# EAGLE design Fluxamasynth32 (EAGLE 9.0.0)
ABBREV: Flux3; AUTHOR: Nadya B.; PROJECT: Fluxamasynth 3
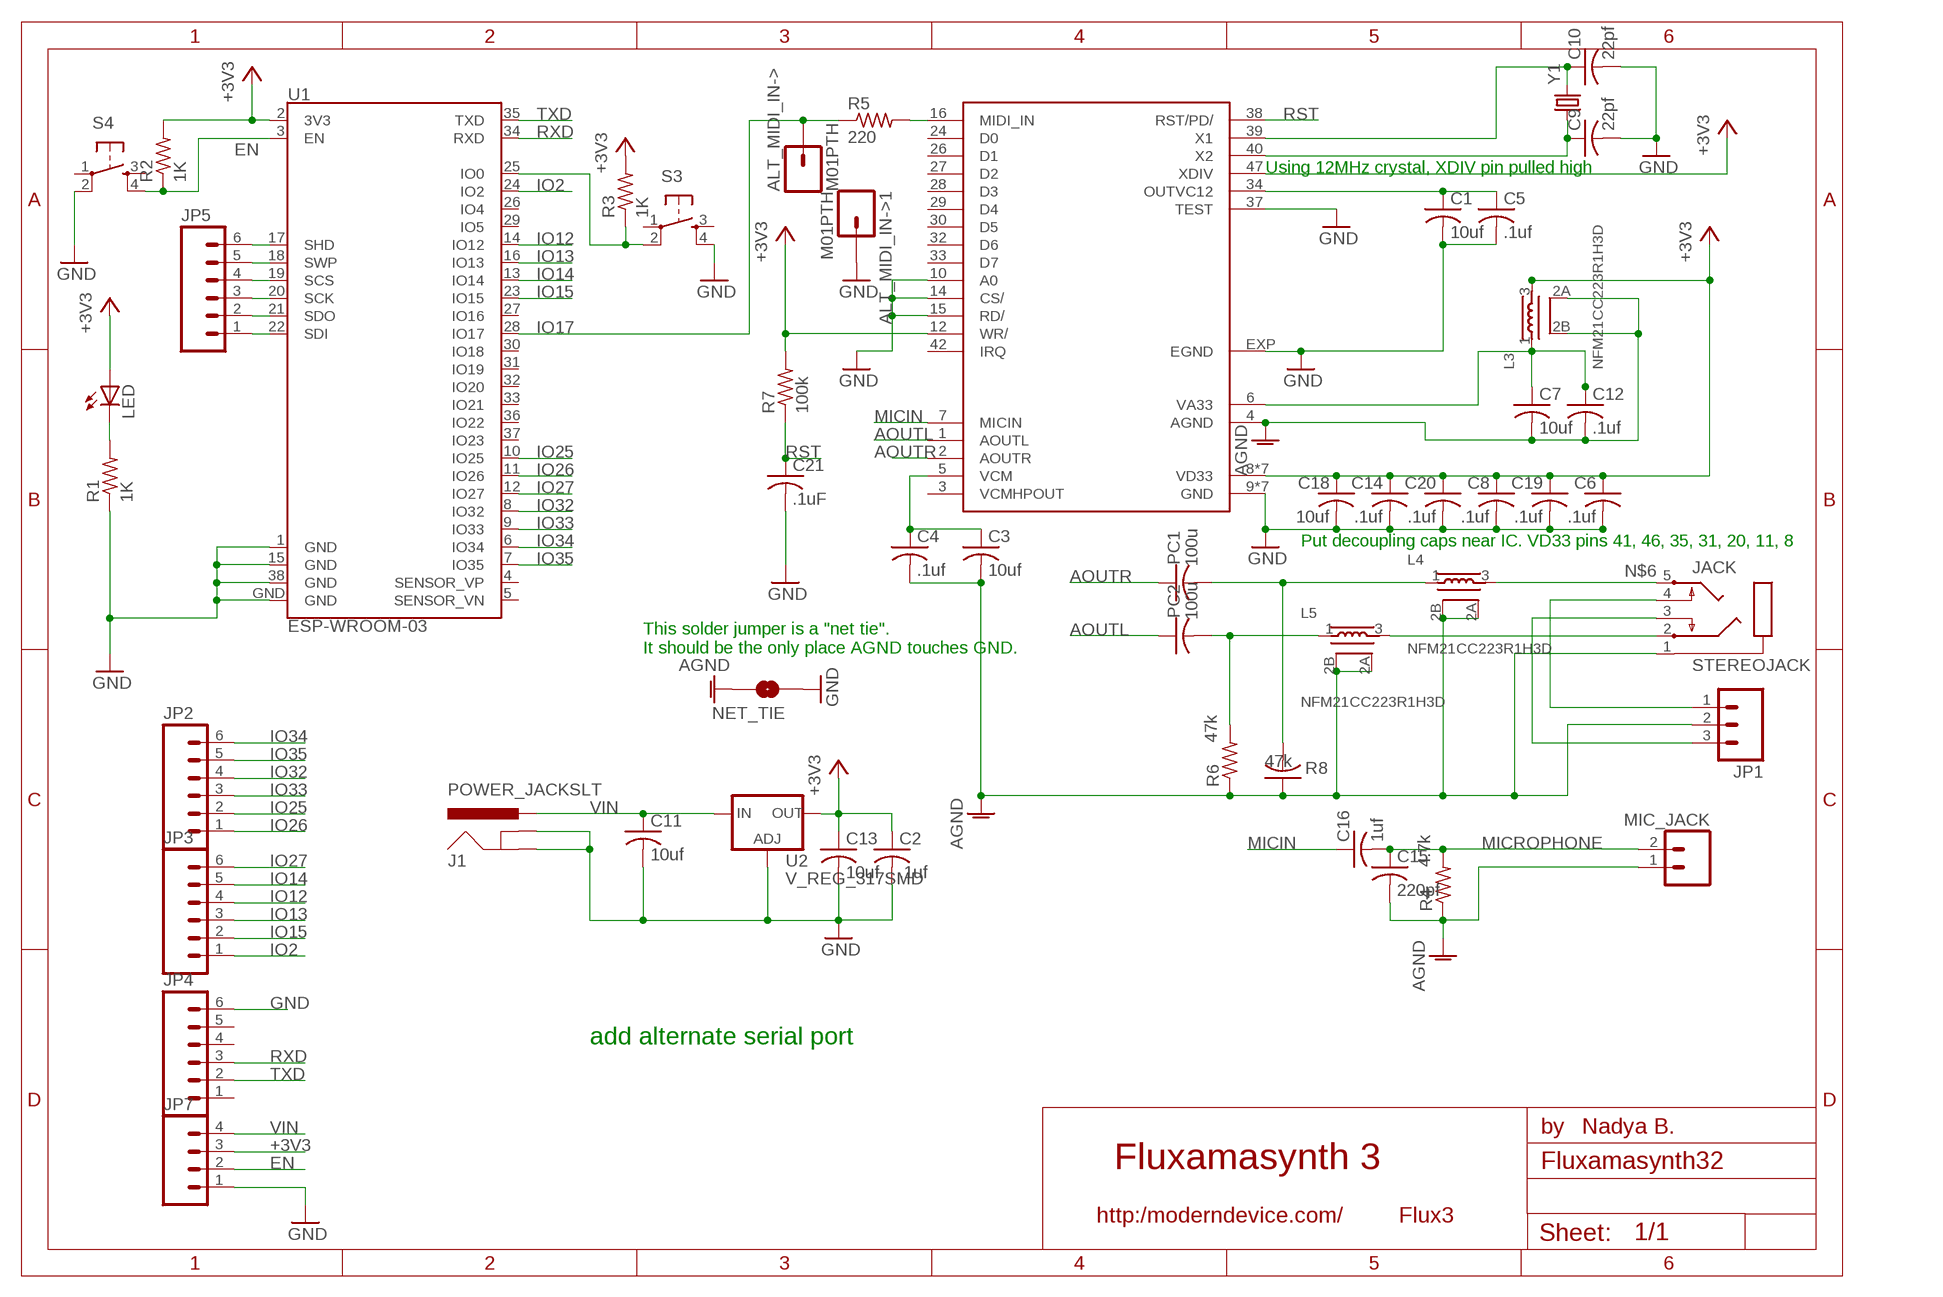
[diagram p0: schematic, sheet 1]

## Parts
ALT_MIDI_IN->  M01PTH  [1X01]
ALT_MIDI_IN->1  M01PTH  [1X01]
C1  10uf  C-USC0805K  [C0805K]
C2  .1uf  C-USC0603K  [C0603K]
C3  10uf  C-USC0805K  [C0805K]
C4  .1uf  C-USC0603K  [C0603K]
C5  .1uf  C-USC0603K  [C0603K]
C6  .1uf  C-USC0603K  [C0603K]
C7  10uf  C-USC0805K  [C0805K]
C8  .1uf  C-USC0603K  [C0603K]
C9  22pf  C-USC0603  [C0603]
C10  22pf  C-USC0603  [C0603]
C11  10uf  C-USC1206  [C1206]
C12  .1uf  C-USC0603K  [C0603K]
C13  10uf  C-USC1206  [C1206]
C14  .1uf  C-USC0603K  [C0603K]
C15  220pf  C-USC0805K  [C0805K]
C16  1uf  C-USC0603K  [C0603K]
C18  10uf  C-USC0603K  [C0603K]
C19  .1uf  C-USC0603K  [C0603K]
C20  .1uf  C-USC0603K  [C0603K]
C21  .1uF  C-USC0603K  [C0603K]
J1  POWER_JACKSLT  [POWER_JACK_SLOT]
JACK  STEREOJACK  [STX3100]
JP1  M03PTH  [1X03]
JP2  M06NO_SILK  [1X06_NO_SILK]
JP3  M06NO_SILK  [1X06_NO_SILK]
JP4  M06NO_SILK  [1X06_NO_SILK]
JP5  M06NO_SILK  [1X06_NO_SILK]
JP7  M041X04_NO_SILK  [1X04_NO_SILK]
L3  NFM21CC223R1H3D  [3PC]
L4  NFM21CC223R1H3D  [3PC]
L5  NFM21CC223R1H3D  [3PC]
LED  LED0603  [LED-0603]
MIC_JACK  M02PTH  [1X02]
NET_TIE  MODERNDEVICE_SOLDERJUMPERTRACE  [MODERNDEVICE_SJ_2S-TRACE]
PC1  100u  C-USC1206K  [C1206K]
PC2  100u  C-USC1206K  [C1206K]
R1  1K  R-US_R0603  [R0603]
R2  1K  R-US_R0603  [R0603]
R3  1K  R-US_R0603  [R0603]
R4  4.7k  R-US_R0603  [R0603]
R5  220  R-US_R0603  [R0603]
R6  47k  R-US_R0603  [R0603]
R7  100k  R-US_R0603  [R0603]
R8  47k  C-USC0603K  [C0603K]
S3  6MM_SWITCH6MM_SWITCH  [6MM_SWITCH]
S4  6MM_SWITCH6MM_SWITCH  [6MM_SWITCH]
SAM2695  SAM2695  [QFN48]
U1  ESP-WROOM-03  [ESP-WROOM-03]
U2  V_REG_317SMD  [SOT223]
Y1  CRYSTALTXC-7A  [CRYSTAL-TXC-7A]

## Nets
+3V3 [VCC]: C2.1 C6.1 C8.1 C13.1 C14.1 C18.1 C19.1 C20.1 JP7.3 L3.3 LED.A R2.2 R3.2 R7.2 SAM2695.8(VD33) SAM2695.11(VD33) SAM2695.12(WR/) SAM2695.20(VD33) SAM2695.31(VD33) SAM2695.35(VD33) SAM2695.41(VD33) SAM2695.46(VD33) SAM2695.47(XDIV) U1.2(3V3) U2.2(OUT) U2.4(OUT)
AGND [GND]: C3.2 C4.2 C7.2 C12.2 C15.2 JACK.1 JP1.2 L3.2A L3.2B L4.2A L4.2B L5.2A L5.2B MIC_JACK.1 NET_TIE.2 R4.1 R6.1 R8.1 SAM2695.4(AGND)
AOUTL: PC2.1 SAM2695.1(AOUTL)
AOUTR: PC1.1 SAM2695.2(AOUTR)
EN: JP7.2 R2.1 S4.4(S1) U1.3(EN)
GND [GND]: ALT_MIDI_IN->1.1 C1.2 C2.2 C5.2 C6.2 C8.2 C9.2 C10.2 C11.2 C13.2 C14.2 C18.2 C19.2 C20.2 C21.2 J1.GND@1(GNDBREAK) J1.GND@2(GND) JP4.6 JP7.1 NET_TIE.1 R1.1 S3.4(S1) S4.2(P1) SAM2695.9(GND) SAM2695.10(A0) SAM2695.13(GND) SAM2695.14(CS/) SAM2695.15(RD/) SAM2695.18(GND) SAM2695.25(GND) SAM2695.36(GND) SAM2695.37(TEST) SAM2695.45(GND) SAM2695.48(GND) SAM2695.EXP(EGND) U1.1(GND) U1.15(GND) U1.38(GND) U1.GND U2.1(ADJ)
IO2: JP3.1 U1.24(IO2)
IO12: JP3.4 U1.14(IO12)
IO13: JP3.3 U1.16(IO13)
IO14: JP3.5 U1.13(IO14)
IO15: JP3.2 U1.23(IO15)
IO17: ALT_MIDI_IN->.1 R5.1 U1.28(IO17)
IO25: JP2.2 U1.10(IO25)
IO26: JP2.1 U1.11(IO26)
IO27: JP3.6 U1.12(IO27)
IO32: JP2.4 U1.8(IO32)
IO33: JP2.3 U1.9(IO33)
IO34: JP2.6 U1.6(IO34)
IO35: JP2.5 U1.7(IO35)
MICIN: C16.1 SAM2695.7(MICIN)
MICROPHONE: C15.1 C16.2 MIC_JACK.2 R4.2
N$1: R3.1 S3.2(P1) U1.25(IO0)
N$4: JP5.1 U1.22(SDI)
N$5: L5.1 PC2.2 R6.2
N$6: JACK.5 L4.3
N$7: JP5.2 U1.21(SDO)
N$8: JP5.3 U1.20(SCK)
N$9: LED.C R1.2
N$10: JP5.4 U1.19(SCS)
N$11: JP5.5 U1.18(SWP)
N$12: R5.2 SAM2695.16(MIDI_IN)
N$13: JP5.6 U1.17(SHD)
N$21: JACK.4 JP1.1
N$24: JACK.3 JP1.3
OUT_L: JACK.2 L5.3
OUT_R: L4.1 PC1.2 R8.2
OUTVC12: C1.1 C5.1 SAM2695.34(OUTVC12)
RST: C21.1 R7.1 SAM2695.38(RST/PD/)
RXD: JP4.3 U1.34(RXD)
TXD: JP4.2 U1.35(TXD)
VA33 [VCC]: C7.1 C12.1 L3.1 SAM2695.6(VA33)
VCM: C3.1 C4.1 SAM2695.5(VCM)
VIN [VCC]: C11.1 J1.PWR JP7.4 U2.3(IN)
XTL1: C10.1 SAM2695.39(X1) Y1.P$2
XTL2: C9.1 SAM2695.40(X2) Y1.P$1
Unconnected: JP4.1 JP4.4 JP4.5 S3.1(P) S3.3(S) S4.1(P) S4.3(S) SAM2695.3(VCMHPOUT) SAM2695.24(D0) SAM2695.26(D1) SAM2695.27(D2) SAM2695.28(D3) SAM2695.29(D4) SAM2695.30(D5) SAM2695.32(D6) SAM2695.33(D7) SAM2695.42(IRQ) U1.4(SENSOR_VP) U1.5(SENSOR_VN) U1.26(IO4) U1.27(IO16) U1.29(IO5) U1.30(IO18) U1.31(IO19) U1.32(IO20) U1.33(IO21) U1.36(IO22) U1.37(IO23)

## Notes on the sheet
- Using 12MHz crystal, XDIV pin pulled high
- Put decoupling caps near IC. VD33 pins 41, 46, 35, 31, 20, 11, 8
- This solder jumper is a "net tie".
  It should be the only place AGND touches GND.
- add alternate serial port

## Library data of the parts
ALT_MIDI_IN-> ALT_MIDI_IN->1 = ModernDevice:M01: Header 1 Standard 1-pin 0.1" header. Use with straight break away headers (SKU : PRT-00116), right angle break away headers (PRT-00553), swiss pins (PRT-00743), machine pins (PRT-00117), and female headers (PRT-00115).
C1-C16 C18-C21 PC1 PC2 R8 = ModernDevice:C-US: CAPACITOR, American symbol
J1 = ModernDevice:POWER_JACK: Power Jack This is the standard 5.5mm barrel jack for power. The PTH is the most common, proven, reliable, footprint. All others are experimental. The Slot footprint only works if the mill layer is transmitted to the PCB fab house so be warned. Spark Fun Electronics SKU : PRT-00119. Mating wall wart : TOL-00298 (and others)
JACK = ModernDevice:STEREOJACK: MIC/HEADPHONE JACK Stereo jack with two switches. Kycon STX3100, CUI SJ1-3555NG and/or 4UCon 05544
JP1 = ModernDevice:M03: Header 3 Standard 3-pin 0.1" header. Use with straight break away headers (SKU : PRT-00116), right angle break away headers (PRT-00553), swiss pins (PRT-00743), machine pins (PRT-00117), and female headers (PRT-00115). Molex polarized connector foot print use with SKU : PRT-08232 with associated crimp pins and housings.
JP2-JP5 = ModernDevice:M06: Header 6 Standard 6-pin 0.1" header. Use with straight break away headers (SKU : PRT-00116), right angle break away headers (PRT-00553), swiss pins (PRT-00743), machine pins (PRT-00117), and female headers (PRT-00115). Molex polarized connector foot print use with SKU : PRT-08094 with associated crimp pins and housings. NOTES ON THE VARIANTS LOCK and LOCK_LONGPADS... This footprint was designed to help hold the alignment of a through-hole component (i.e. 6-pin header) while soldering it into place. You may notice that each hole has been shifted either up or down by 0.005 of an inch from it's more standard position (which is a perfectly straight line). This slight alteration caused the pins (the squares in the middle) to touch the edges of the holes. Because they are alternating, it causes a "brace" to hold the component in place. 0.005 has proven to be the perfect amount of "off-center" position when using our standard breakaway headers. Although looks a little odd when you look at the bare footprint, once you have a header in there, the alteration is very hard to notice. Also, if you push a header all the way into place, it is covered up entirely on the bottom side. This idea of altering the position of holes to aid alignment will be further integrated into the Sparkfun Library for other footprints. It can help hold any component with 3 or more connection pins.
JP7 = ModernDevice:M04: Header 4 Standard 4-pin 0.1" header. Use with straight break away headers (SKU : PRT-00116), right angle break away headers (PRT-00553), swiss pins (PRT-00743), machine pins (PRT-00117), and female headers (PRT-00115). Molex polarized connector foot print use with SKU : PRT-08231 with associated crimp pins and housings.
L3-L5 = ModernDevice:NFM21CC223R1H3D: CAPACITOR-TYPE NOISE SUPPRESSION FILTER digikey #NFM21CC223R1H3D
LED = ModernDevice:LED: LEDs Standard schematic elements and footprints for 5mm, 3mm, 1206, and 0603 sized LEDs. 5mm - Spark Fun Electronics SKU : COM-00529 (and others)
MIC_JACK = ModernDevice:M02: Header 2 Standard 2-pin 0.1" header. Use with straight break away headers (SKU : PRT-00116), right angle break away headers (PRT-00553), swiss pins (PRT-00743), machine pins (PRT-00117), and female headers (PRT-00115). Molex polarized connector foot print use with SKU : PRT-08233 with associated crimp pins and housings.
NET_TIE = BBLeo_v2:MODERNDEVICE_SOLDERJUMPER: Solder Jumper Standard SMD solder jumper. Used to automate production. Two varients : Normally Open and Normally Closed are the same, but have different paste layers. NC will have a large amount of paste and should jumper during reflow.
R1-R7 = ModernDevice:R-US_: RESISTOR, American symbol
S3 S4 = fab:6MM_SWITCH: OMRON SWITCH
SAM2695 = ModernDevice:SAM2695
U1 = esp32:ESP-WROOM-03
U2 = ModernDevice:V_REG_317: Voltage Regulator Standard LM317 adjustable voltage regulator. AOI (Adjust Output Input). Google 'LM317 Calculator' for easy to use app to get the two resistor values needed. 240/720 for 5V output. 240/390 for 3.3V output. Spark Fun Electronics SKU : COM-00527
Y1 = SparkFun-FreqCtrl:CRYSTAL: Various standard crystals. Proven footprints. Spark Fun Electronics SKU : COM-00534

## Net classes
0 default: width 0.152 mm, drill 0.152 mm, clearance 0.152 mm
1 GND: width 0.152 mm, drill 0.152 mm, clearance 0.152 mm
2 VCC: width 0.152 mm, drill 0.152 mm, clearance 0.152 mm
3 VBUS: width 0.152 mm, drill 0.152 mm, clearance 0.152 mm

## Board
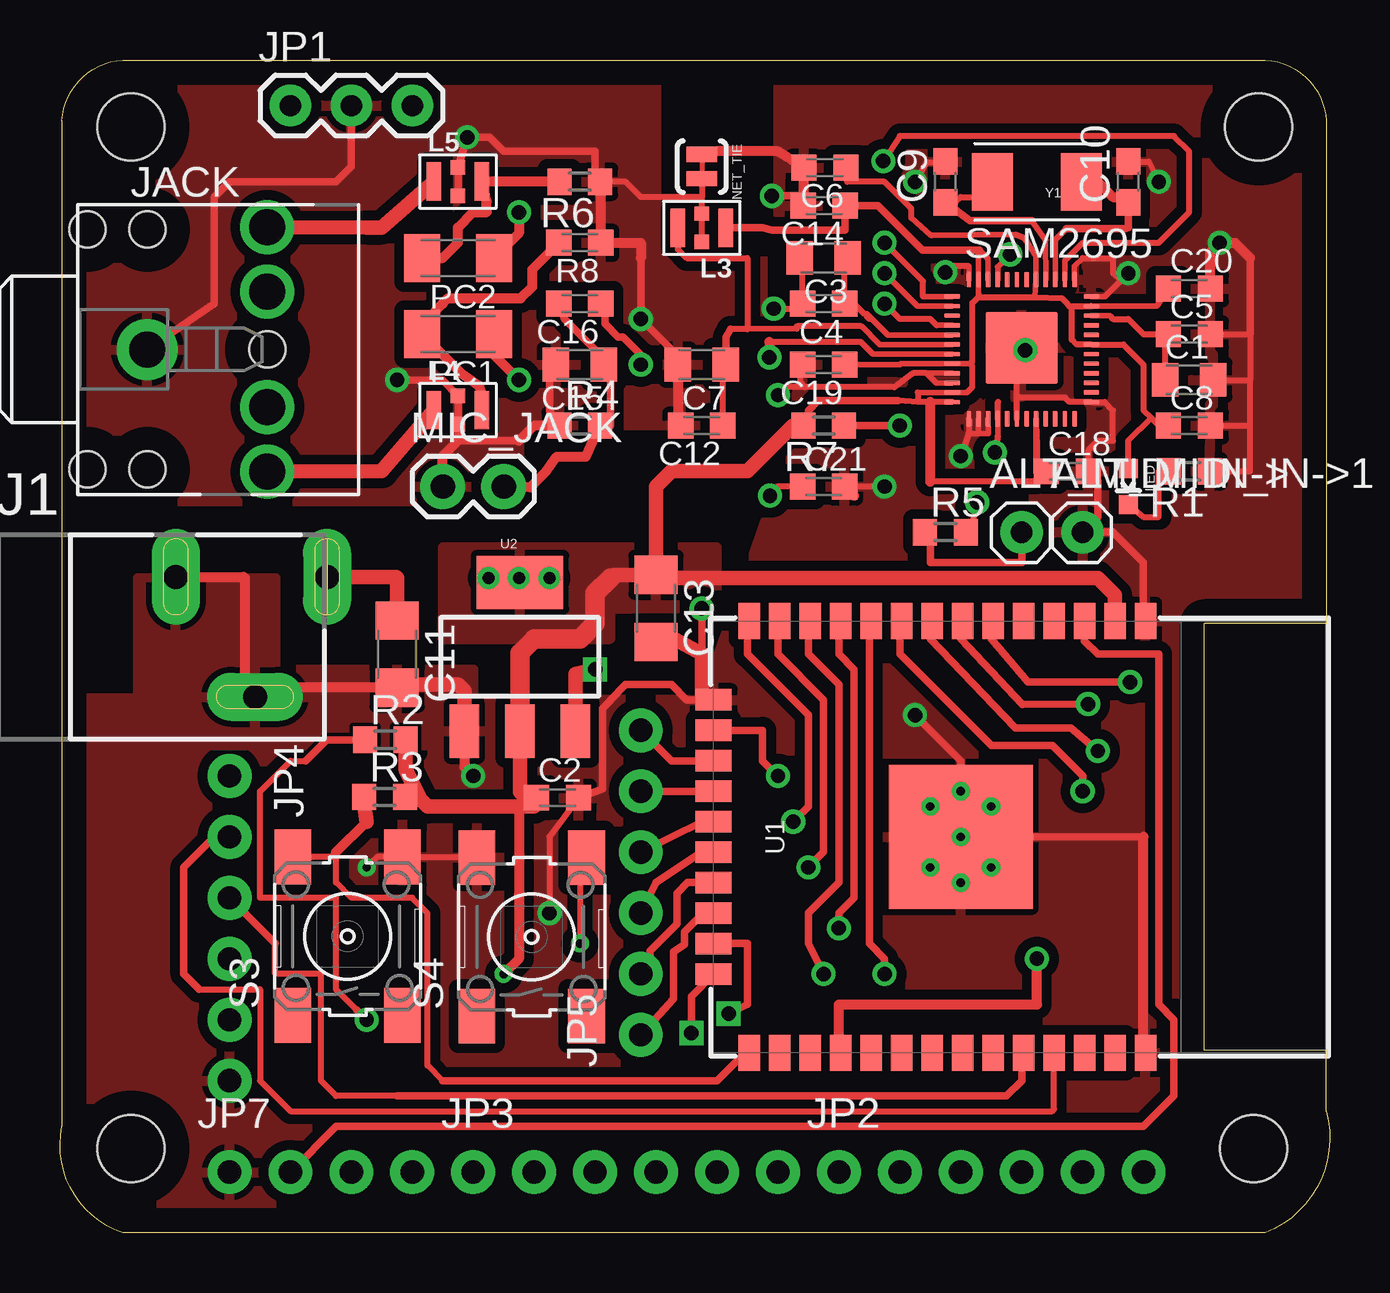
[diagram p1: board, top side]
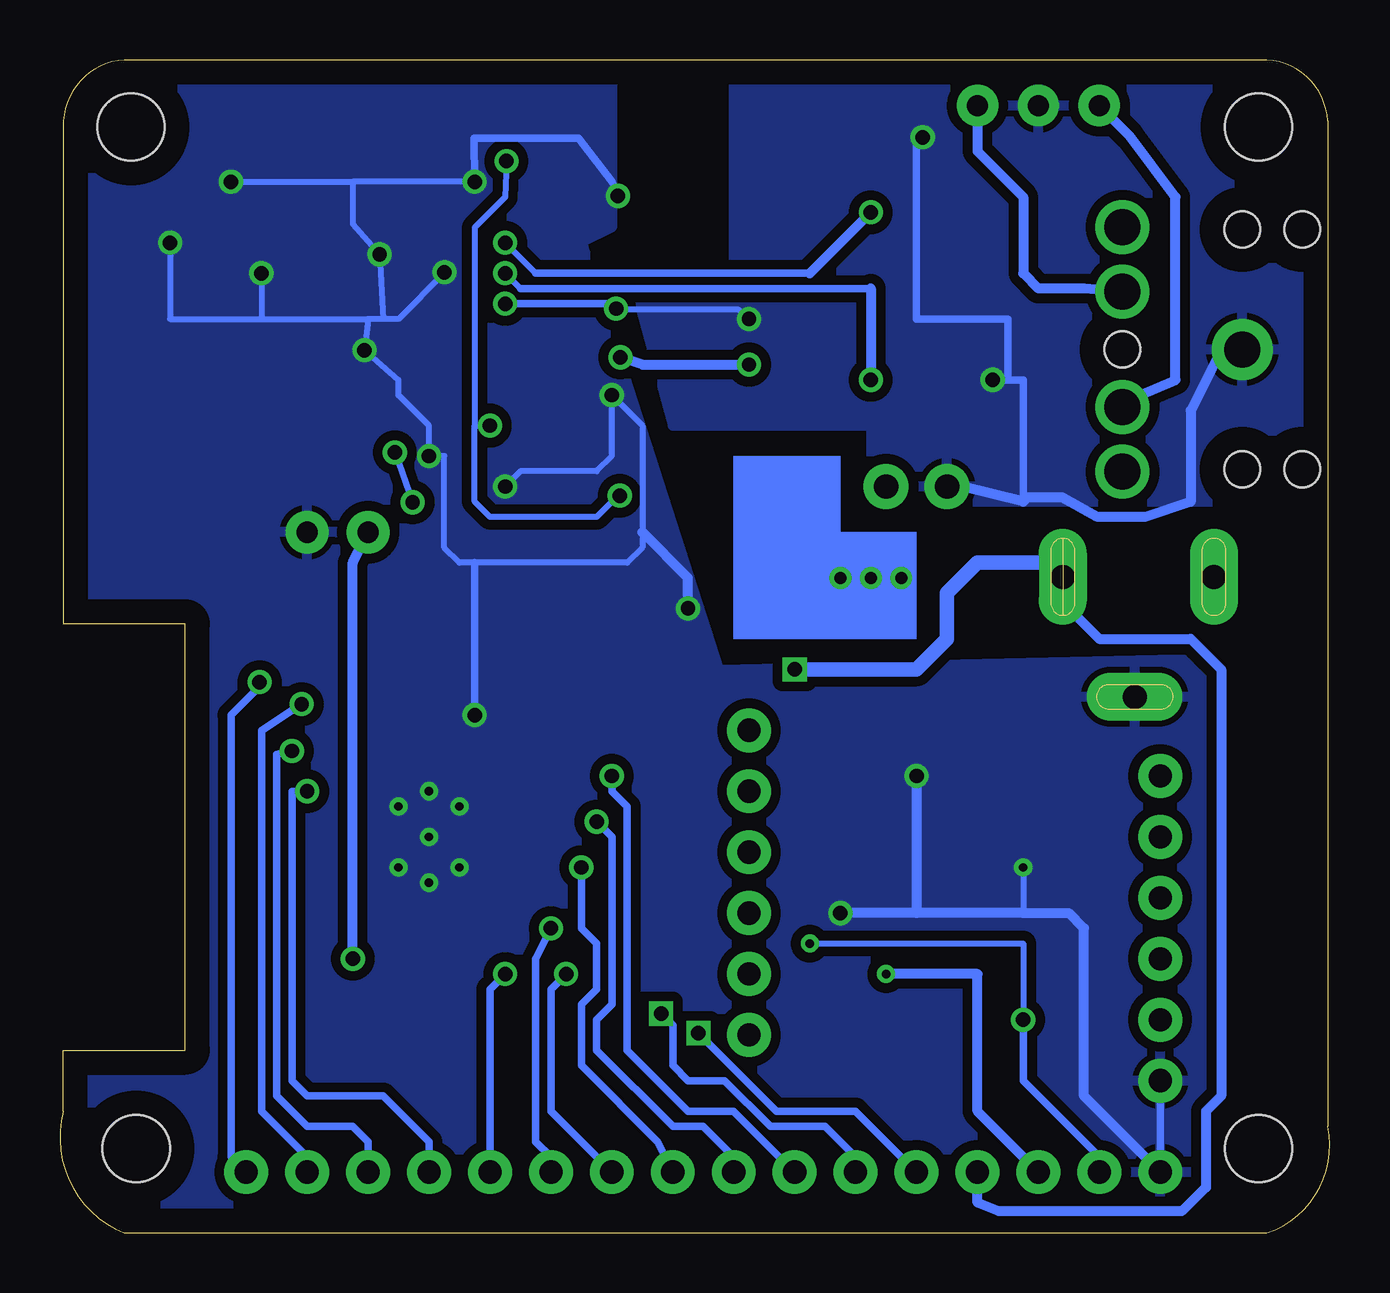
[diagram p2: board, bottom side, seen from below]

Size 52.93 x 48.89 mm. Coordinates in mm from the lower left corner, seen from the top.
Outline: 52.79,46.35 52.79,25.4 47.71,25.4 47.71,7.62 52.79,7.62 52.79,5.08 arc-83 50.25,0 2.62,0 arc-83 0.08,4.45 0.08,46.35 arc-83 2.62,48.89 50.25,48.89 arc-83 52.79,46.35
Copper layers (1*16): Top 0.035mm / dielectric 1.5mm / Bottom 0.035mm
Design rules "default *": minimum track width 6mil, minimum drill 0.35mm, track to track 6mil, track to pad 6mil, pad to pad 6mil, via to via 6mil, smd to smd 6mil, copper to edge 40mil, drill to drill 6mil, minimum pad ring 10mil, minimum via ring 8mil, stop-mask expansion 4mil, vias tented up to drill 25mil, thermal gap 10mil
Holes 2.8 mm at 2.97,46.1 2.97,3.52 49.97,46.1 49.75,3.52

### Footprints (pad centres in the part's own frame; a part is rotated, then mirrored left to right if it is on the bottom)
1X01 = drill 0.889 pad 1.778: 1 0,0
C0805K = smd 1.1 x 1.4: 1 -1,0; 2 1,0
C0603K = smd 1.05 x 1.08: 1 -0.875,0; 2 0.875,0
C0603 = smd 1.1 x 1: 1 -0.85,0; 2 0.85,0
C1206 = smd 1.6 x 1.8: 1 -1.4,0; 2 1.4,0
POWER_JACK_SLOT = drill 1 pad 2 long: GND@1 2.58,7.5; GND@2 7.58,10.8; PWR 2.58,13.8
STX3100 = drill 1.5 pad 2.54: 1 2.929,0.002 | drill 1.5: 2 7.929,5.102; 3 7.929,2.402; 4 7.929,-2.398; 5 7.929,-5.098 | hole 1.5: 2.929,5.002; 2.929,-4.998; 7.929,0.002; 0.429,5.002; 0.429,-4.998
1X03 = drill 0.889 pad 1.727: 1 0,0; 2 2.54,0; 3 5.08,0
1X06_NO_SILK = drill 0.965 pad 1.829: 1 0,0; 2 2.54,0; 3 5.08,0; 4 7.62,0; 5 10.16,0; 6 12.7,0
1X04_NO_SILK = drill 0.965 pad 1.829: 1 0,0; 2 2.54,0; 3 5.08,0; 4 7.62,0
3PC = smd 0.6 x 1.6: 1 0.998,0.013; 3 -1,0.01 | smd 0.6 x 0.6: 2A 0,-0.58; 2B 0,0.6
LED-0603 = smd 0.8 x 0.8: A 0,-0.75; C 0,0.75
1X02 = drill 1.016 pad 1.88: 1 0,0; 2 2.54,0
MODERNDEVICE_SJ_2S-TRACE = smd 0.635 x 1.27: 1 -0.508,0; 2 0.508,0
C1206K = smd 1.5 x 2: 1 -1.5,0; 2 1.5,0
R0603 = smd 1 x 1.1: 1 -0.85,0; 2 0.85,0
6MM_SWITCH = smd 2.286 x 1.524: 1 -3.302,2.286; 2 3.302,2.286; 3 -3.302,-2.286; 4 3.302,-2.286
QFN48 = smd 0.65 x 0.2: 1 -2.9,2.206; 2 -2.9,1.806; 3 -2.9,1.406; 4 -2.9,1.006; 5 -2.9,0.606; 6 -2.9,0.206; 7 -2.9,-0.194; 8 -2.9,-0.594; 9 -2.9,-0.994; 10 -2.9,-1.394; 11 -2.9,-1.794; 12 -2.9,-2.194; 25 2.9,-2.194; 26 2.9,-1.794; 27 2.9,-1.394; 28 2.9,-0.994; 29 2.9,-0.594; 30 2.9,-0.194; 31 2.9,0.206; 32 2.9,0.606; 33 2.9,1.006; 34 2.9,1.406; 35 2.9,1.806; 36 2.9,2.206 | smd 0.2 x 0.65: 13 -2.2,-2.894; 14 -1.8,-2.894; 15 -1.4,-2.894; 16 -1,-2.894; 17 -0.6,-2.894; 18 -0.2,-2.894; 19 0.2,-2.894; 20 0.6,-2.894; 21 1,-2.894; 22 1.4,-2.894; 23 1.8,-2.894; 24 2.2,-2.894; 37 2.2,2.906; 38 1.8,2.906; 39 1.4,2.906; 40 1,2.906; 41 0.6,2.906; 42 0.2,2.906; 43 -0.2,2.906; 44 -0.6,2.906; 45 -1,2.906; 46 -1.4,2.906; 47 -1.8,2.906; 48 -2.2,2.906 | smd 3 x 3: EXP -0.002,0.067
ESP-WROOM-03 = smd 0.9 x 1.5: 1 7.7,9; 2 6.43,9; 3 5.16,9; 4 3.89,9; 5 2.62,9; 6 1.35,9; 7 0.08,9; 8 -1.19,9; 9 -2.46,9; 10 -3.73,9; 11 -5,9; 12 -6.27,9; 13 -7.54,9; 14 -8.81,9; 25 -8.81,-9; 26 -7.54,-9; 27 -6.27,-9; 28 -5,-9; 29 -3.73,-9; 30 -2.46,-9; 31 -1.19,-9; 32 0.08,-9; 33 1.35,-9; 34 2.62,-9; 35 3.89,-9; 36 5.16,-9; 37 6.43,-9; 38 7.7,-9 | smd 1.5 x 0.9: 15 -10.3,5.715; 16 -10.3,4.445; 17 -10.3,3.175; 18 -10.3,1.905; 19 -10.3,0.635; 20 -10.3,-0.635; 21 -10.3,-1.905; 22 -10.3,-3.175; 23 -10.3,-4.445; 24 -10.3,-5.715 | smd 6 x 6: GND 0,0
SOT223 = smd 1.219 x 2.235: 1 -2.311,-3.099; 2 0,-3.099; 3 2.311,-3.099 | smd 3.6 x 2.2: 4 0,3.099
CRYSTAL-TXC-7A = smd 1.7 x 2.4: P$1 1.85,0; P$2 -1.85,0

### Placement (x,y rotation side)
ALT_MIDI_IN->  40.09,29.21 0 top
ALT_MIDI_IN->1  42.63,29.21 0 top
C1  47.07,35.56 0 top
C2  20.73,18.14 0 top
C3  31.83,40.64 180 top
C4  31.83,38.73 180 top
C5  47.07,37.46 0 top
C6  31.88,44.4 180 top
C7  26.75,36.2 180 top
C8  47.07,33.66 0 top
C9  36.91,43.81 90 top
C10  44.53,43.81 90 top
C11  14.05,24.13 270 top
C12  26.75,33.66 180 top
C13  24.85,26.04 270 top
C14  31.86,42.82 180 top
C15  21.67,36.2 180 top
C16  21.67,38.73 180 top
C18  41.99,31.75 0 top
C19  31.83,36.2 180 top
C20  47.07,39.37 0 top
C21  31.83,31.11 0 top
J1  -2.67,29.93 270 top
JACK  0.72,36.83 0 top
JP1  9.61,46.99 0 top
JP2  32.47,2.54 0 top
JP3  17.23,2.54 0 top
JP4  7.07,19.05 270 top
JP5  24.21,8.25 90 top
JP7  7.07,2.54 0 top
L3  26.75,41.91 180 top
L4  16.59,34.29 0 top
L5  16.59,43.81 0 top
LED  44.53,31.11 180 top
MIC_JACK  15.96,31.11 0 top
NET_TIE  26.75,44.45 270 top
PC1  16.59,37.46 180 top
PC2  16.59,40.64 180 top
R1  47.07,31.75 180 top
R2  13.57,20.56 0 top
R3  13.53,18.18 0 top
R4  21.67,33.66 0 top
R5  36.91,29.21 0 top
R6  21.67,43.81 180 top
R7  31.83,33.66 180 top
R8  21.67,41.27 180 top
S3  11.99,12.37 90 top
S4  19.66,12.34 90 top
SAM2695  40.09,36.83 0 top
U1  37.55,16.51 0 top
U2  19.17,24.02 0 top
Y1  40.72,43.81 180 top

### Tracks (layer width: path | path; a pad name or v marks a point on that pad's centre or on a via)
+3V3  (via drill 0.35)
  Top 0.229: SAM2695.35 45.7,38.64 | 38.28,39.14 SAM2695.47 38.29,40.87 | 40.64,39.01 SAM2695.41 40.67,40.64 40.67,40.69 40.31,41.3 | 35.75,35.04 SAM2695.11 37.81,35.04 | C19.1 35.01,36.2 35.05,36.24 SAM2695.8 37.82,36.24 37.83,36.25 37.93,36.25 | SAM2695.46 38.69,40.62 38.33,40.97
  Top 0.254: 45.7,38.64 45.8,38.73 C20.1 | 45.48,33.97 45.17,34.29 45.17,36.2 44.32,37.04 SAM2695.31 42.37,37.04 42.17,37.24 42.17,38.53 42.07,38.63 | 45.48,33.97 45.8,33.66 C8.1 | 42.07,38.63 41.99,38.71 41.99,38.73 41.76,38.96 40.64,39.01 38.28,39.01 | 42.07,38.63 SAM2695.35 | 38.28,39.14 38.28,39.01 | LED.A 44.53,33.02 45.48,33.97 | C18.1 40.72,32.15 40.72,33.02 40.7,33.12 SAM2695.20 40.69,31.79 40.72,31.32 36.28,31.32 | 35.75,35.04 35.76,34.64 | 35.76,34.64 34.93,34.7 | SAM2695.12 36.28,34.64 35.76,34.64 | 37.81,35.04 38.03,35.26 38.03,36.14 37.93,36.25 37.95,36.25 38.03,36.32 38.03,38.76 38.28,39.01 | 40.31,41.3 40.19,41.48 39.83,41.6 36.33,41.58 35.49,42.32 35.49,42.7 34.37,43.81 32.81,43.81 C6.1 | 38.29,40.87 38.18,40.97
  Top 0.305: 38.33,40.97 38.18,40.97 35.95,40.97 34.09,42.82 C14.1 32.72,41.81 29.67,41.81 29.29,41.91 28.02,41.91 L3.3 | 34.93,34.7 31.6,34.7 31.2,34.29 31.2,33.87 R7.2
  Top 0.406: 36.28,31.32 36.28,34.64 | C2.1 20.04,18.14 19.77,17.78 | 19.13,17.78 19.13,14.1 19.13,11.43 v18.5,10.8
  Top 0.61: U2.2 19.17,18.38 19.77,17.78 19.13,17.78 15.32,17.78 15,18.1 | C13.1 23.07,27.43 22.94,27.3 | R2.2 14.42,19.32 15,18.1 | R3.2 14.45,18.18 15,18.1 | U1.2 43.98,26.59 43.26,27.3 24.98,27.3 C13.1 | C13.1 24.85,31.11 25.48,31.75 28.66,31.75 30.56,33.66 R7.2
  Top 0.813: U2.2 19.17,24.17 19.77,24.77 21.67,24.77 22.31,25.4 22.31,26.67 22.94,27.3
  Bottom 0.406: JP7.3 14.69,5.08 14.69,10.8 v18.5,10.8
  pour Top (isolate 0.406): 15.96,27.94 15.96,24.77 22.94,24.77 22.94,26.04 27.39,26.04 27.39,28.57 15.96,28.57
AGND  (via drill 0.6)
  Top 0.229: SAM2695.4 36.54,37.84
  Top 0.254: 36.54,37.84 36.28,38.1 35.01,38.1 v34.37,38.73 | C3.2 30.96,40.52 C4.2 30.75,38.53 v29.75,38.53 | L3.2B L3.2A 26.75,43.18 | NET_TIE.2 26.75,43.18 | 26.75,43.18 24.21,43.18 23.58,43.81 R6.1
  Top 0.305: v14.05,35.56 15.96,35.56 L4.2B L4.2A 16.59,33.02 19.13,33.02 | L5.2A L5.2B v16.97,45.67 17.91,45.67 18.5,45.09 22.31,45.09 22.31,44.03 R6.1 | 24.21,40.64 v24.21,38.1 25.48,36.83 25.48,36.46 C7.2 | JACK.1 6.43,38.73 6.43,43.18 7.07,43.81 11.51,43.81 12.15,44.45 JP1.2 | R4.1 20.4,34.29 20.4,35.56 C15.2
  Top 0.406: C7.2 25.75,33.78 C12.2 | 24.21,40.64 24.21,41.27 R8.1 22.55,43.79 R6.1 | R4.1 19.77,33.66 19.13,33.02 | MIC_JACK.1 15.96,32.38 16.59,33.02 | 12.15,46.35 JP1.2
  Bottom 0.254: 29.93,38.73 29.93,38.71 | v24.21,38.1 24.26,38.1 24.64,38.48 29.7,38.48
  Bottom 0.305: v14.05,35.56 13.42,35.56 | 13.42,35.56 12.78,35.56 12.78,30.48 | 13.42,35.56 13.42,38.1 17.23,38.1 17.23,45.41 v16.97,45.67 | v34.37,38.73 29.93,38.73 | 29.93,38.71 v29.75,38.53 29.7,38.48
  Bottom 0.406: JACK.1 4.52,36.83 5.8,34.29 5.8,30.48 7.7,29.84 9.68,29.84 11.15,30.66 12.6,30.66 12.78,30.48 15.32,31.11 MIC_JACK.1
  pour Top (isolate 0.406): -0.55,30.48 0.08,49.53 24.85,49.53 24.85,40.64 29.29,40.64 29.29,33.66 19.13,33.66 19.13,30.48
  pour Bottom (isolate 0.406): -0.55,30.48 -1.19,51.44 24.85,51.44 24.85,40.64 29.29,40.64 27.39,33.66 19.13,33.66 19.13,30.48
AOUTL  (via drill 0.6)
  Top 0.229: SAM2695.1 35.97,39.04
  Top 0.254: 35.97,39.04 35.97,39.67 v34.37,41.27
  Top 0.406: v19.13,42.55 19.13,41.68 PC2.1
  Bottom 0.254: v34.37,41.27 33.1,40.01
  Bottom 0.305: 33.1,40.01 21.67,40.01
  Bottom 0.406: 21.67,40.01 v19.13,42.55
AOUTR  (via drill 0.6)
  Top 0.229: SAM2695.2 35.74,38.64
  Top 0.254: 35.74,38.64 v34.37,40.01
  Top 0.406: v19.13,35.56 17.86,36.83 17.86,37.23 PC1.1
  Bottom 0.254: v34.37,40.01 33.74,39.37
  Bottom 0.305: 33.74,39.37 19.13,39.37
  Bottom 0.406: 19.13,39.37 v19.13,35.56
EN  (via drill 0.35, 0.6)
  Top 0.254: v12.78,8.89 11.51,10.16 11.51,13.97 8.34,13.97 8.34,18.41 9.61,19.68 10.24,19.68 | S4.4 21.67,14.61 v21.67,12.07
  Top 0.305: 12.39,20.56 11.12,20.56 10.24,19.68 | U1.3 42.71,24.68 43.26,24.13 45.8,24.13 45.8,9.53 46.44,8.89 46.44,5.71 45.17,4.45 11.51,4.45 JP7.2 | 12.36,9.31 v12.78,8.89
  Top 0.406: R2.1 12.39,20.56
  Bottom 0.254: v21.67,12.07 12.78,12.07 v12.78,8.89
  Bottom 0.305: v12.78,8.89 12.78,6.35 9.61,3.17 JP7.2
GND  (via drill 0.35, 0.6)
  Top 0.229: SAM2695.36 43.56,39.04 | SAM2695.37 42.29,40.3 42.63,40.64 | 37.88,33.33 38.28,33.33 | 38.28,33.33 38.69,33.33 SAM2695.15 | SAM2695.14 38.28,33.33 | SAM2695.9 36.12,35.84 | SAM2695.10 36.52,35.44 | SAM2695.45 39.09,40.27 | SAM2695.48 37.89,40.3 | SAM2695.13 37.89,33.36
  Top 0.254: C1.2 49.61,35.56 | 49.61,35.56 49.61,37.46 C5.2 | C8.2 49.61,33.66 | 49.61,33.66 49.61,35.56 | 43.56,39.04 44.21,39.69 | 42.63,40.64 43.9,40.64 43.9,40.01 44.21,39.69 | SAM2695.13 37.88,33.33 | 31.04,35.26 34.78,35.26 35.56,35.84 36.12,35.84 36.52,35.44 | 31.04,35.26 30.87,35.46 30.87,36.1 C19.2 | SAM2695.18 39.89,34.92 | 39.89,34.92 39.89,36.63 | 39.89,34.92 39.99,34.82 41.89,34.82 42.08,34.64 SAM2695.25 43.55,34.64 43.9,34.29 43.9,33.02 43.26,33.02 42.87,32.62 C18.2 | 37.89,40.3 37.15,40.3 v36.9,40.05 | 39.09,40.27 v39.6,40.79 | 36.91,44.62 36.11,44.62 v35.64,43.81 | C10.2 45.38,44.66 v45.8,43.81 | 44.21,39.69 v44.53,40.01 | R1.1 49.61,31.75 49.61,33.66 | 37.89,33.36 v37.55,32.38 | 31.04,35.26 30.26,35.26 v29.93,34.92 | v34.37,31.11 C21.2 | v12.78,15.24 13.21,15.67 S3.4 14.3,15.65 S4.2 | C2.2 20.4,16.51 v20.4,13.34
  Top 0.305: C14.2 31.01,43.23 v29.67,43.23 | 8.34,22.56 8.51,22.73 | 26.75,22.22 26.12,22.22 25.48,22.86 23.58,22.86 22.94,22.22 22.94,22.2 22.61,21.87 22.61,18.51 C2.2 | U1.1 45.17,25.59 45.17,27.94 43.9,29.21 ALT_MIDI_IN->1.1 43.26,29.84 43.26,31.36 C18.2 | v35.64,21.59 37.55,19.68 v37.55,18.41 U1.GND | U1.GND 45.17,16.51 | 26.75,24.13 v26.75,26.04 | 49.61,40.64 49.61,37.46 | U1.GND v38.82,17.78 | U1.GND v38.82,15.24 | U1.GND v37.55,14.61 | U1.GND v36.28,15.24 | U1.GND v36.28,17.78
  Top 0.406: 36.91,44.62 C9.2 | 33.1,30.72 C21.2 | 31.01,43.23 C6.2 29.93,45.09 27.39,45.09 NET_TIE.1 | U1.38 45.17,7.51 45.17,16.51 | J1.GND@1 7.66,27.35 7.7,27.3 7.7,22.77 J1.GND@2 8.51,22.73 C11.2 | v20.4,13.34 20.58,13.34 | U2.1 16.86,19.42 v17.23,19.05 | C20.2 47.95,40.88 v48.34,41.27 48.98,41.27 49.61,40.64
  Top 0.61: U2.1 16.86,22.59 16.59,22.86 14.18,22.86 C11.2 | 24.85,24.55 C13.2 25.61,24.77 26.75,24.13 26.75,22.22 U1.15
  Bottom 0.254: v48.34,41.27 48.34,38.1 44.53,38.1 | 44.53,38.1 40.09,38.1 | 40.09,38.1 v40.24,36.8 38.82,35.56 38.82,34.92 37.55,33.66 v37.55,32.38 36.91,32.38 36.91,28.57 36.28,27.94 35.64,27.94 29.29,27.94 28.66,28.57 28.66,29.21 28.66,33.66 v29.93,34.92 29.93,32.38 30.56,31.75 33.74,31.75 v34.37,31.11 | v36.9,40.05 36.95,40.05 36.91,40.01 38.82,38.1 39.45,38.1 | 39.45,38.1 40.09,38.1 | 39.45,38.1 v39.6,40.79 40.72,42.06 40.72,43.81 | v45.8,43.81 40.72,43.81 | v35.64,43.81 40.72,43.81 | v44.53,40.01 44.53,38.1 | v12.78,15.24 12.78,13.34
  Bottom 0.305: v29.67,43.23 29.93,43.81 31.32,45.64 35.67,45.64 v35.64,43.81 | v35.64,21.59 35.64,27.94 | JP4.6 JP7.1
  Bottom 0.406: JP7.1 10.24,5.71 10.24,12.7 10.88,13.34 12.78,13.34 17.23,13.34 | 17.23,13.34 v20.4,13.34 | v17.23,19.05 17.23,13.34 | v26.75,26.04 26.75,27.3 28.66,29.21
  other vias: 37.55,16.51
  pour Bottom (isolate 0.406): 29.93,50.16 29.93,41.91 31.2,41.27 25.48,23.49 -5.66,24.21 -5.66,-3.73 54.06,-3.81 54.06,50.16
  pour Top (isolate 0.406): 29.93,51.44 29.93,41.91 31.2,41.27 30.56,33.02 26.75,22.22 -4.06,22.3 -4.06,-1.83 54.69,-1.91 54.69,51.44
  pour Top: 3.26,20.32 3.26,27.3 8.97,27.3 8.97,23.49 17.23,23.49 17.23,20.32
IO2  (via drill 0.6)
  Top 0.305: v26.32,8.33 26.32,9.87 U1.24
  Bottom 0.305: JP3.1 19.77,5.08 23.07,5.08 v26.32,8.33
IO12  (via drill 0.6)
  Top 0.305: v30.56,17.14 31.2,17.78 31.2,21.59 28.66,24.13 28.66,25.43 U1.14
  Bottom 0.305: JP3.4 24.85,3.17 26.12,4.45 27.39,4.45 30.56,7.62 30.56,8.89 29.93,9.53 29.93,16.51 v30.56,17.14
IO13  (via drill 0.6)
  Top 0.305: 26.75,20.95 U1.16 29.29,20.95 29.29,19.68 v29.93,19.05
  Bottom 0.305: v29.93,19.05 29.93,18.41 29.29,17.78 29.29,7.62 26.75,5.08 24.85,5.08 JP3.3
IO14  (via drill 0.6)
  Top 0.305: 29.93,25.43 29.93,24.13 31.83,22.22 31.83,15.88 v31.2,15.24
  Top 0.406: 29.93,25.43 U1.13
  Bottom 0.305: JP3.5 28.02,3.81 31.2,6.99 31.2,9.53 30.56,10.16 30.56,12.07 31.2,12.7 v31.2,15.24
IO15  (via drill 0.6)
  Top 0.305: v27.87,9.14 28.66,9.53 28.66,12.07 U1.23
  Bottom 0.305: JP3.2 19.77,3.17 21.04,4.45 23.32,4.45 25.23,6.35 26.75,6.35 27.39,6.99 27.39,8.66 v27.87,9.14
IO17  (via drill 0.6)
  Top 0.305: ALT_MIDI_IN->.1 40.09,27.94 36.28,27.94 36.28,28.99 R5.1
  Top 0.406: U1.28 arc-90 32.47,7.59 32.47,9.53 40.72,9.53 v40.72,11.43
  Bottom 0.406: v40.72,11.43 40.72,27.94 ALT_MIDI_IN->.1
IO25  (via drill 0.6)
  Top 0.305: v34.37,10.8 34.37,11.43 33.74,12.07 33.74,25.43 U1.10
  Bottom 0.305: JP2.2 35.01,10.16 v34.37,10.8
IO26  (via drill 0.6)
  Top 0.305: v32.47,12.7 32.47,13.34 33.1,13.97 33.1,23.49 32.47,24.13 32.47,25.43 U1.11
  Bottom 0.305: v32.47,12.7 33.1,11.43 33.1,3.81 32.47,3.17 JP2.1
IO27  (via drill 0.6)
  Top 0.305: v31.83,10.8 31.2,12.07 31.2,13.34 32.47,14.61 32.47,22.86 31.2,24.13 31.2,25.43 U1.12
  Bottom 0.305: v31.83,10.8 32.47,10.16 32.47,5.08 JP3.6
IO32  (via drill 0.6)
  Top 0.305: U1.8 36.28,25.43 36.28,24.77 39.83,21.06 42.14,21.06 v43.26,20.09
  Bottom 0.305: v43.26,20.09 43.9,19.94 43.9,5.71 42.63,4.45 40.72,4.45 40.09,3.81 JP2.4
IO33  (via drill 0.6)
  Top 0.305: v42.63,18.41 42.63,19.05 41.36,20.32 38.82,20.32 35.01,24.13 35.01,25.59 | 35.01,26.04 35.01,25.59 | 35.01,25.59 U1.9
  Bottom 0.305: JP2.3 37.55,3.81 39.45,5.71 42.63,5.71 43.26,6.35 43.26,18.41 v42.63,18.41
IO34  (via drill 0.6)
  Top 0.305: v44.61,22.96 40.34,22.96 38.82,24.77 38.82,25.43 U1.6
  Bottom 0.305: v44.61,22.96 44.61,22.78 45.8,21.59 45.8,3.17 JP2.6
IO35  (via drill 0.6)
  Top 0.305: 37.55,25.43 U1.7 37.55,25.59 | v42.85,22.05 40.11,22.02 37.55,24.77 37.55,25.59 | 37.55,26.04 37.55,25.59
  Bottom 0.305: JP2.5 42.63,3.17 44.53,5.08 44.53,20.95 v42.85,22.05
MICIN  (via drill 0.6)
  Top 0.229: SAM2695.7 33.88,36.64
  Top 0.254: 33.88,36.64 33.38,37.13 29.57,37.13
  Top 0.305: v24.21,36.2 24.21,36.6 23.47,37.34 23.27,37.34 22.71,37.9 22.71,38.57 C16.1
  Top 0.406: 29.57,37.13 v29.57,36.5 | 22.31,38.49 C16.1
  Bottom 0.406: v29.57,36.5 28.63,36.2 v24.21,36.2
MICROPHONE
  Top 0.305: R4.2 22.94,33.66 22.94,35.56 C15.1 22.31,36.83 21.04,38.1 C16.2
  Top 0.406: MIC_JACK.2 19.61,31.09 20.25,31.72 20.71,32.36 21.92,32.36 R4.2
N$1
  Top 0.254: S3.2 11.31,15.67 11.51,15.88 11.51,14.61 12.15,13.97 14.69,13.97 15.32,13.34 15.32,6.99 15.96,6.35
  Top 0.305: U1.25 28.55,7.51 27.39,6.35 15.96,6.35
  Top 0.406: 11.51,15.88 12.78,17.14
  Top 0.61: R3.1 12.68,17.88 12.78,17.14
N$2  (via drill 0.5)
  other vias: 17.86,27.3
N$3  (via drill 0.5)
  other vias: 19.13,27.3
N$4
  Top 0.305: U1.22 26.83,13.34 26.04,12.55 26.04,12.04 25.58,11.71 25.58,9.75 JP5.1
N$5
  Top 0.406: PC2.2 15.96,40.64 16.59,41.27 16.59,41.91 17.23,42.55 17.76,42.55 17.78,42.57 17.78,43 L5.1 17.6,43.81 R6.2
N$6
  Top 0.61: JACK.5 13.42,31.75 L4.3
N$7
  Top 0.305: U1.21 26.17,14.61 25.71,14.15 25.71,12.88 24.59,11.76 24.59,11.18 JP5.2
N$8
  Top 0.305: U1.20 26.75,15.88 24.85,14.61 JP5.3
N$9
  Top 0.254: LED.C 45.17,29.84 45.8,29.84 45.8,31.75 R1.2
N$10
  Top 0.305: U1.19 26.75,17.14 JP5.4
N$11
  Top 0.305: U1.18 JP5.5
N$12  (via drill 0.6)
  Top 0.229: SAM2695.16 39.09,33.23
  Top 0.254: SAM2695.16 39.09,34.65 | 39.09,33.23 v38.97,32.54 | v38.23,30.45 37.98,29.43 R5.2
  Bottom 0.254: v38.97,32.54 v38.23,30.45
N$13
  Top 0.305: U1.17 25.48,19.68 JP5.6
N$14  (via drill 0.5)
  other vias: 20.4,27.3
N$21
  Bottom 0.406: JACK.4 8.64,34.62 6.43,35.56 6.43,43.18 8.34,45.72 JP1.1
N$24
  Bottom 0.406: JACK.3 10.24,39.37 12.15,39.37 12.78,40.01 12.78,43.18 14.69,45.09 JP1.3
OUT_L
  Top 0.61: JACK.2 12.78,41.91 13.42,41.91 L5.3
OUT_R
  Top 0.406: L4.1 17.59,34.92 17.48,35.31 16.74,35.81 PC1.2 15.32,37.46 15.32,38.1 15.96,38.73 15.96,38.76 16.16,38.96 19.21,38.96 19.69,39.45 19.69,40.17 R8.2
OUTVC12
  Top 0.229: SAM2695.34 43.76,38.24
  Top 0.254: 43.76,38.24 43.9,38.1 44.53,38.1 45.17,37.46 C5.1 46.07,37.34 C1.1
RST  (via drill 0.6)
  Top 0.229: SAM2695.38 41.89,40.53 42.63,41.27
  Top 0.254: 42.63,41.27 45.8,41.27 47.07,42.55 47.07,45.09 46.44,45.72 35.01,45.72 v34.32,44.68 | C21.1 29.93,31.11 29.93,31.06 v29.6,30.73
  Top 0.305: v35.01,33.66 R7.1
  Top 0.406: C21.1 30.56,31.11
  Bottom 0.254: v34.32,44.68 34.37,43.18 35.64,41.91 35.64,33.66 | 35.64,33.66 v35.01,33.66 | v29.6,30.73 29.67,30.73 30.56,29.84 35.01,29.84 35.64,30.48 35.64,33.66
RXD
  Top 0.254: 14.05,5.71 11.51,5.71 10.88,6.35 10.88,10.8 8.97,10.8 8.97,12.07
  Top 0.305: 14.05,5.71 39.45,5.71 40.09,6.35 40.09,7.43 U1.34 | JP4.3 8.97,12.07
TXD
  Top 0.254: 5.8,10.16 8.34,10.16 8.34,6.35 9.61,5.08 41.36,5.08 41.44,5.16 U1.35
  Top 0.305: 5.8,10.16 5.16,10.8 5.16,15.24 6.43,16.51 JP4.2
VA33
  Top 0.229: SAM2695.6 34.16,37.04
  Top 0.254: 34.16,37.04 33.41,37.8 30.71,37.8 30.71,37.69 28.66,37.67 | 28.66,37.67 27.94,37.67 | C12.1 27.63,36.07 C7.1 | L3.1 25.75,41 26.12,40.64 28.66,40.64 28.66,37.67
  Top 0.305: 27.94,37.67 27.77,37.34 C7.1
VCM
  Top 0.229: SAM2695.5 34.5,37.44
  Top 0.254: 34.5,37.44 33.63,38.3 | 33.63,38.3 33.53,38.3 33.1,38.73 C4.1 32.71,40.52 C3.1 | 33.63,38.3 33.63,38.2 33.74,38.1
VIN  (via drill 0.6)
  Top 0.61: C11.1 14.05,27.3 14.01,27.35 J1.PWR | U2.3 21.48,23.31 v22.31,23.49
  Bottom 0.406: J1.PWR 11.13,26.29 9.61,24.77 5.8,24.77 4.53,23.49 4.53,5.71 5.16,5.08 5.16,1.91 6.18,0.91 13.8,0.91 14.69,1.27 JP7.4
  Bottom 0.61: v22.31,23.49 17.23,23.49 15.96,24.77 15.96,26.67 14.69,27.94 11.72,27.94 J1.PWR
XTL1
  Top 0.229: SAM2695.39 41.48,41.4
  Top 0.254: 41.48,41.4 41.94,41.86
  Top 0.305: 41.94,41.86 44.4,41.86 44.53,41.91 C10.1
  Top 0.406: Y1.P$2 43.26,43.81 43.9,43.18 44.32,43.18 C10.1
XTL2
  Top 0.229: SAM2695.40 41.08,41.4
  Top 0.254: 41.08,41.4 40.52,42.19 | C9.1 37.33,42.96 37.55,43.18 38.6,43.18 38.96,42.82
  Top 0.305: C9.1 37.93,42.19 40.52,42.19
  Top 0.406: Y1.P$1 38.6,43.81 38.6,43.18
(copper drawn outside any net)
  shapes: Bottom area x2

### Text on the board
200bmp: THRU
201bmp: /Users/as220/_FluxamasynthGithub/_Fluxamasynth32/Artwork/FLUXYNTHbOTTOMsILK.bmp